# Altium schematic sheet Carte.de.gestion.de.batterie.Li-ion.SchDoc: Project2
size A4; Date: 05/05/2026; ApprovedBy: YYY; CheckedBy: YYY; Author: YYY; DrawnBy: NAIT BENALI Younes; SheetNumber: 1; SheetTotal: 1
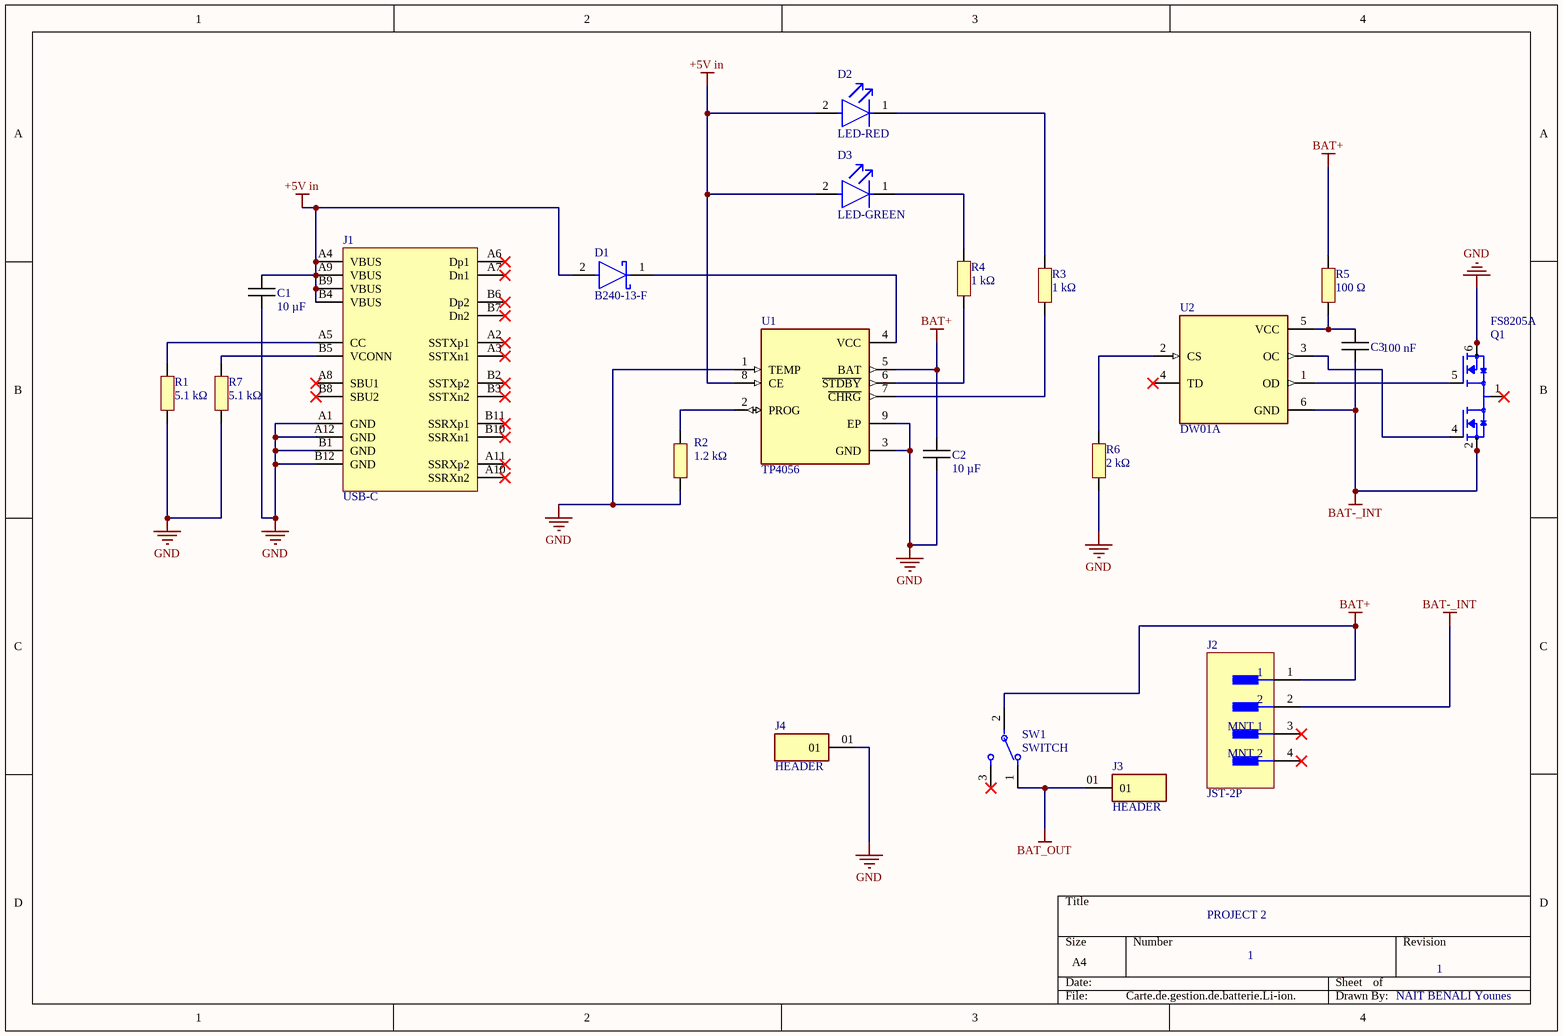
[diagram p0: Carte.de.gestion.de.batterie.Li-ion.SchDoc]

## Parts
C1  10 µF  [SMD-1005-CAP]
C2  10 µF  [SMD-1005-CAP]
C3  100 nF  [SMD-1005-CAP]
D1  B240-13-F  [SMD-DIODE-SCHOTTKY]
D2  LED-RED  [SMD-1608-LED]
D3  LED-GREEN  [SMD-1608-LED]
J1  USB-C  [USB-C]
J2  JST-2P  [SMD-JST-2P]
J3  HEADER  [HEADER]
J4  HEADER  [HEADER]
Q1  FS8205A  [FS8205A]
R1  5.1 kΩ  [SMD-1005-RES]
R2  1.2 kΩ  [SMD-1005-RES]
R3  1 kΩ  [SMD-1005-RES]
R4  1 kΩ  [SMD-1005-RES]
R5  100 Ω  [SMD-1005-RES]
R6  2 kΩ  [SMD-1005-RES]
R7  5.1 kΩ  [SMD-1005-RES]
SW1  SWITCH  [SMD-SWITCH]
U1  TP4056  [SOP-8-TP4056]
U2  DW01A  [DW01A]

## Nets
+5V in: C1.1 D1.2(A) D2.2(A) D3.2(A) J1.A4(VBUS) J1.A9(VBUS) J1.B4(VBUS) J1.B9(VBUS) U1.8(CE)
BAT+: C2.1 J2.1 R5.2 SW1.2(C) U1.5(BAT)
BAT-_INT: C3.2 J2.2 Q1.2(S1) Q1.3(S1) U2.6(GND)
BAT_OUT: J3.01 SW1.1
GND: C1.2 C2.2 J1.A1(GND) J1.A12(GND) J1.B1(GND) J1.B12(GND) J4.01 Q1.6(S2) Q1.7(S2) R1.1 R2.1 R6.1 R7.1 U1.1(TEMP) U1.3(GND) U1.9(EP)
NetC3_1: C3.1 R5.1 U2.5(VCC)
NetD1_1: D1.1(C) U1.4(VCC)
NetD2_1: D2.1(C) R3.2
NetD3_1: D3.1(C) R4.1
NetJ1_A5: J1.A5(CC) R1.2
NetJ1_B5: J1.B5(VCONN) R7.2
NetQ1_1: Q1.1(D12) Q1.8(D12)
NetQ1_4: Q1.4(G1) U2.3(OC)
NetQ1_5: Q1.5(G2) U2.1(OD)
NetR2_2: R2.2 U1.2(PROG)
NetR3_1: R3.1 U1.7(~{CHRG})
NetR4_2: R4.2 U1.6(~{STDBY})
NetR6_2: R6.2 U2.2(CS)

Not connected (* = marked no-connect by the designer): J1 A2(SSTXp1)* A3(SSTXn1)* A6(Dp1)* A7(Dn1)* A8(SBU1)* A10(SSRXn2)* A11(SSRXp2)* B2(SSTXp2)* B3(SSTXn2)* B6(Dp2)* B7(Dn2)* B8(SBU2)* B10(SSRXn1)* B11(SSRXp1)*; J2 3(MNT_1)* 4(MNT_2)*; SW1 3*; U2 4(TD)*

## Notes on the sheet
- PROJECT 2
- 1
- NAIT BENALI Younes

## Library data of the parts
C1-C3 = CAPACITOR
D1 = DIODE-SCHOTTKY-B240-13-F: DIODE SCHOTTKY 40V 2A SMB; Manufacturer: Diodes Inc.; Capacitance: 200pF; Peak Reverse Current: 0.5mA; Max Junction Temp: +150°C; Value: 200pF; Max Surge Forward Current: 50A; Standoff Height: 0.05mm; Forward Current: 2A; Device Class L2: Diodes; Device Class L1: Discrete Semiconductors; Reverse Voltage: 40V; Automotive: No; Lead Free: Yes; Octopart: https://octopart.com/b240-13-f-diodes+inc.-325780; Device Class L3: Schottky Diodes; Temperature Range Low: -65°C; RoHS: TRUE; Category: Diode; Max Repetitive Reverse Voltage: 40V; Temperature: -65°C to +150°C; ComponentLink2URL: https://www.diodes.com/assets/Datasheets/ds13004.pdf; Manufacturer Part Number: B240-13-F; Mouser Description: Schottky Diodes & Rectifiers 40V 2A; Temperature Range High: +150°C; Package: SMB; ComponentLink2Description: Datasheet; Footprint Url: https://www.diodes.com/assets/Package-Files/SMB.pdf; Height: 2.5mm; Digikey Description: DIODE SCHOTTKY 40V 2A SMB
D2 = LED-RED: LED GREEN CLEAR CHIP SMD LTST-C190GKT; Dominant Wavelength: 569nm; Reverse Voltage: 5V; Lens Color: Colorless; Viewing Angle: 130°; Voltage: 2V; Forward Current: 30mA; Power Dissipation: 100mW; Luminous Intensity: 6mcd; Number of LEDs: 1; Forward Voltage: 2.1V; Wavelength: 565nm; Test Current: 10mA; Min Operating Temperature: -55°C; Lens Style: Clear; Mount: Surface Mount; Width: 0.8mm; Packaging: Tape and Reel; Lens Transparency: Clear; Case Code (Metric): 1608; Depth: 0.8mm; Case Code (Imperial): 0603; Case/Package: 0603; Number of Pins: 2; Max Operating Temperature: 85°C; Lead Free: Lead Free; Number of Elements: 1; Length: 1.6mm; Height: 0.8mm; Package Quantity: 1; Power Rating: 100mW; Radiation Hardening: No; Illumination Color: Green; Color: Green
D3 = LED-GREEN: LED GREEN CLEAR CHIP SMD LTST-C190GKT; Dominant Wavelength: 569nm; Reverse Voltage: 5V; Lens Color: Colorless; Viewing Angle: 130°; Voltage: 2V; Forward Current: 30mA; Power Dissipation: 100mW; Luminous Intensity: 6mcd; Number of LEDs: 1; Forward Voltage: 2.1V; Wavelength: 565nm; Test Current: 10mA; Min Operating Temperature: -55°C; Lens Style: Clear; Mount: Surface Mount; Width: 0.8mm; Packaging: Tape and Reel; Lens Transparency: Clear; Case Code (Metric): 1608; Depth: 0.8mm; Case Code (Imperial): 0603; Case/Package: 0603; Number of Pins: 2; Max Operating Temperature: 85°C; Lead Free: Lead Free; Number of Elements: 1; Length: 1.6mm; Height: 0.8mm; Package Quantity: 1; Power Rating: 100mW; Radiation Hardening: No; Illumination Color: Green; Color: Green
J1 = USB-C: NexarPartId: 68112675; Pin Length: 1.9mm; Current Rating: 5A; Gender: Receptacle; Voltage Rating: 20V; Number of Contacts: 24; Insulation Resistance: 1GΩ; USB Standard: USB 3.1; Connector Type: USB; Contact Resistance: 30mΩ; Min Operating Temperature: -40°C; Mount: Surface Mount, Through Hole; Height: 3.21mm; Number of Pins: 24; RoHS: Compliant; Orientation: Horizontal; Max Operating Temperature: 105°C; Packaging: Tape and Reel; Contact Material: Gold, Nickel
J2 = JST-2P: Connector Header Surface Mount, Right Angle 2 position 0.079" (2.00mm); NexarPartId: 22059567; Number of Contacts: 2; Gender: Male; Voltage Rating: 250V; Current Rating: 3A; Packaging: Cut Tape; Height: 5.7mm; Max Operating Temperature: 85°C; Mount: Surface Mount; Termination: SMD/SMT; Min Operating Temperature: -25°C; Number of Rows: 1; Contact Plating: Tin; Lead Free: Lead Free; RoHS: Compliant; Contact Material: Copper
J3 J4 = HEADER: Connector Header Through Hole 1 position; MF: Samtec; MP: MTMM-101-05-G-S-225; SnapEDA_Link: https://www.snapeda.com/parts/MTMM-101-05-G-S-225/Samtec/view-part/?ref=snap; Package: None; Value: *; Check_prices: https://www.snapeda.com/parts/MTMM-101-05-G-S-225/Samtec/view-part/?ref=eda
Q1 = FS8205A: N/A; MF: Fortune Semiconductor; MP: FS8205A; Value: *; Availability: Not in stock; Package: Package; Price: None; SnapEDA_Link: https://www.snapeda.com/parts/FS8205A/Fortune+Semiconductor/view-part/?ref=snap; Check_prices: https://www.snapeda.com/parts/FS8205A/Fortune+Semiconductor/view-part/?ref=eda
R1-R7 = RESISTOR
SW1 = SWITCH: SWITCH SLIDE SPDT 300MA 6V JS102011SCQN; Electrical Life: 5000Cycles; Actuator Type: Standard; Contact Resistance: 70mR; Actuator Material: Nylon; Max Voltage Rating (DC): 30V; Actuator Length: 2mm; Switch Function: On-On; Actuator Color: Black; Radiation Hardening: No; Throw Configuration: SPDT; Depth: 7.5mm; Case/Package: SMD/SMT; Package Quantity: 4000; Min Operating Temperature: -40°C; Length: 8.5mm; Current Rating: 300mA; Mount: Surface Mount; Voltage Rating (DC): 6V; RoHS Compliant: Yes; Orientation: Straight; Housing Material: Nylon; Contact Plating: Silver; Max Operating Temperature: 85°C; Packaging: Tape and Reel; Switch Travel: 2mm; Max Current Rating: 300mA; Contact Material: Copper Alloy; Series: JS; Termination: Gull Wing
U1 = TP4056: Complete single cell Li-Ion battery with a constant current / constant voltage linear charger; MF: NanJing Top Power ASIC Corp.; Check_prices: https://www.snapeda.com/parts/TP4056/NanJing+Top+Power+ASIC+Corp./view-part/?ref=eda; SnapEDA_Link: https://www.snapeda.com/parts/TP4056/NanJing+Top+Power+ASIC+Corp./view-part/?ref=snap; Price: None; Availability: Not in stock; Package: Package; MP: TP4056; Value: *
U2 = DW01A: One Cell Lithium-ion/Polymer Battery Protection IC; MF: Fortune Semiconductor; SnapEDA_Link: https://www.snapeda.com/parts/DW01A/Fortune+Semiconductor/view-part/?ref=snap; Package: SOT-23-6 Fortune Semiconductor; Value: *; MP: DW01A; Check_prices: https://www.snapeda.com/parts/DW01A/Fortune+Semiconductor/view-part/?ref=eda